# Altium schematic sheet bat-ckt.SchDoc
size A4; SheetNumber: 3; SheetTotal: 5
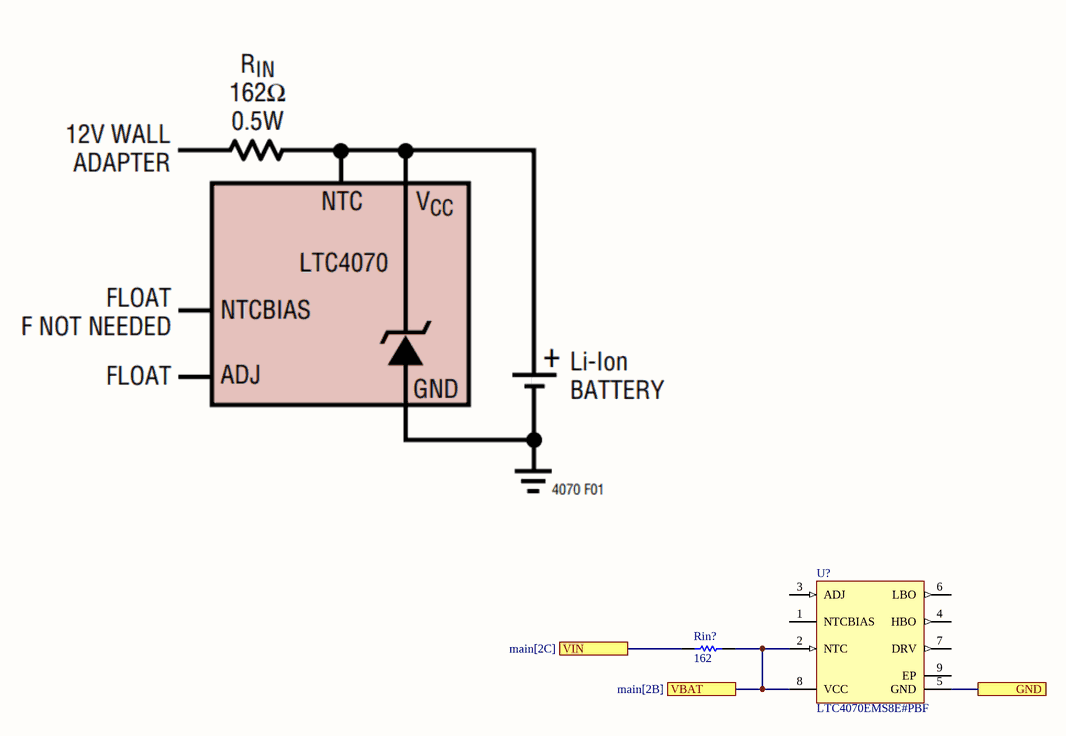
[diagram p0: bat-ckt.SchDoc]

## Parts
Rin?  value 162  (hidden comment: Resistor)
U?  LTC4070EMS8E#PBF  [LT-MS8E-8-2060X1830TP_M]

## Ports
GND, VBAT (see main[2B]), VIN (see main[2C])

## Nets
GND: U?.5(GND) ; port GND
VBAT: Rin?.2 U?.2(NTC) U?.8(VCC) ; port VBAT
VIN: Rin?.1 ; port VIN

Not connected (* = marked no-connect by the designer): U? 1(NTCBIAS) 3(ADJ) 4(HBO) 6(LBO) 7(DRV) 9(EP)

## Library data of the parts
Rin? = Resistor: TC1: 0; SimulationGenericComponent: True; TC2: 0
U? = CMP-0473-00111-1: Li-Ion / Polymer Shunt Battery Charger System, 8-pin SOP (MS8E-8), -40 to 125 degC, Pb-Free; Manufacturer: Linear Technology; Number of Outputs: 1; Topology: Shunt Battery Charger; ComponentLink3URL: http://cds.linear.com/docs/en/datasheet/4070fc.pdf; PackageReference: MS8E-8; ComponentLink1Description: Manufacturer URL; ComponentLink2URL: http://cds.linear.com/docs/en/datasheet/4070fc.pdf; PackageVersion: Rev. E; ComponentLink3Description: Package Specification; ComponentLink1URL: http://www.linear.com/; PackageDescription: 8-Pin Plastic MSOP, Exposed Die Pad, Body 3 x 3 mm, Pitch 0.65 mm; RoHS: TRUE; Mounting Technology: Surface Mount; DatasheetVersion: Rev. E; PartNumber: LTC4070EMS8E#PBF; ComponentLink2Description: Datasheet